# EAGLE schematic Front Node_MiniLock (EAGLE 8.1.0)
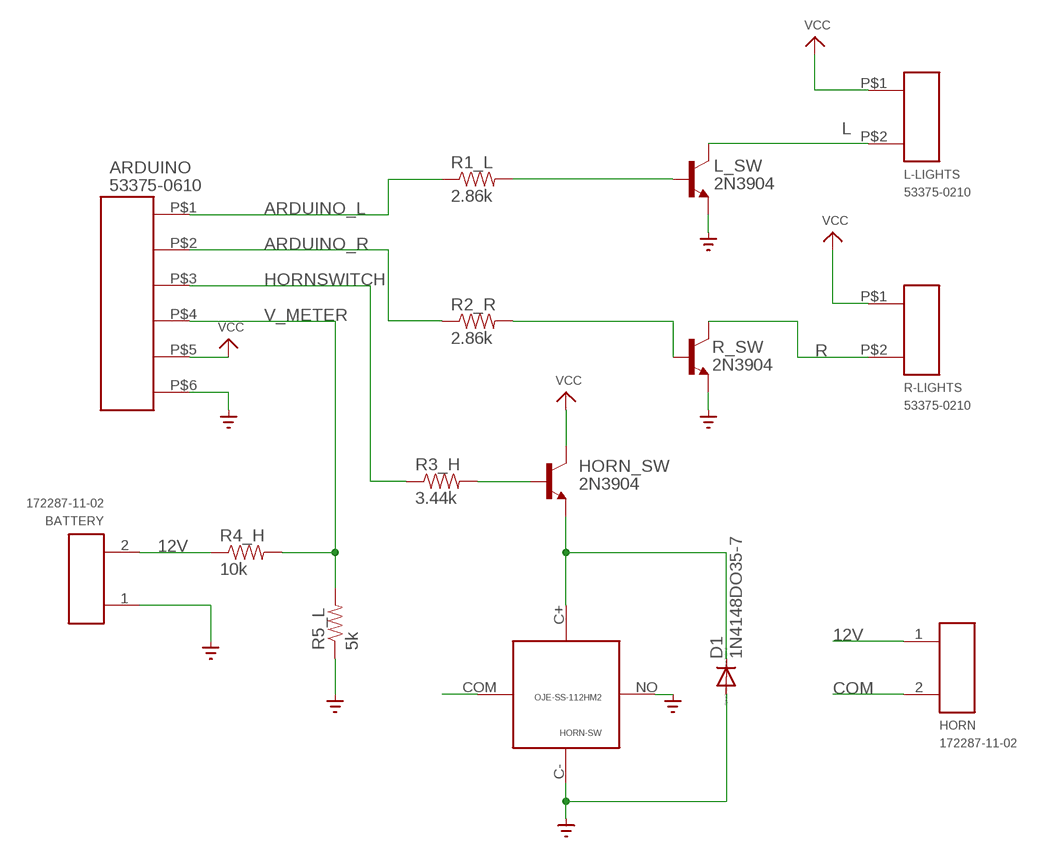
[diagram p0: schematic, sheet 1]

## Parts
ARDUINO  53375-0610  [53375-0610-MINI-LOCK]
BATTERY  172287-11-02  [172287-ULTRA-FIT]
D1  1N4148DO35-7  [DO35-7]
HORN  172287-11-02  [172287-ULTRA-FIT]
HORN-SW  OJE-SS-112HM2  [OJE-SS-112HM2-SPST-RELAY]
HORN_SW  2N3904  [TO92]
L-LIGHTS  53375-0210  [53375-0210-MINI-LOCK]
L_SW  2N3904  [TO92]
R1_L  2.86k  RESISTORPTH-1/6W  [1/6W-RES]
R2_R  2.86k  RESISTORPTH-1/6W  [1/6W-RES]
R3_H  3.44k  RESISTORPTH-1/6W  [1/6W-RES]
R4_H  10k  RESISTORPTH-1/6W  [1/6W-RES]
R5_L  5k  RESISTORPTH-1/6W  [1/6W-RES]
R-LIGHTS  53375-0210  [53375-0210-MINI-LOCK]
R_SW  2N3904  [TO92]

## Nets
12V: BATTERY.2 HORN.1 R4_H.1
ARDUINO_L: ARDUINO.P$1 R1_L.1
ARDUINO_R: ARDUINO.P$2 R2_R.1
COM: HORN-SW.COM HORN.2
GND: ARDUINO.P$6 BATTERY.1 D1.A HORN-SW.C- HORN-SW.NO L_SW.3(E) R5_L.1 R_SW.3(E) ; supply symbol labelled GND_
HORNSWITCH: ARDUINO.P$3 R3_H.1
L: L-LIGHTS.P$2 L_SW.1(C)
N$1: HORN_SW.2(B) R3_H.2
N$2: R2_R.2 R_SW.2(B)
N$3: D1.C HORN-SW.C+ HORN_SW.3(E)
N$8: L_SW.2(B) R1_L.2
R: R-LIGHTS.P$2 R_SW.1(C)
V_METER: ARDUINO.P$4 R4_H.2 R5_L.2
VCC: ARDUINO.P$5 HORN_SW.1(C) L-LIGHTS.P$1 R-LIGHTS.P$1

## Library data of the parts
ARDUINO = Hooman:53375-0610: Mini-Lock Header 6 pin 53375 series
BATTERY HORN = Hooman:172287-11-02: Ultra-Fit™ 172287 Header Molex 3.5 mm pitch 2 pin connector header
D1 = diode:1N4148: DIODE high speed (Philips)
HORN-SW = Hooman:OJE-SS-112HM2: TE SPST RELAY
HORN_SW L_SW R_SW = transistor-neu-to92:2N3904: NPN TRANSISTOR
L-LIGHTS R-LIGHTS = Hooman:53375-0210: Mini-Lock Header 2 pin 53375 series
R1_L R2_R R3_H R4_H R5_L = SparkFun-Passives:RESISTOR: Resistor Basic schematic elements and footprints for 0603, 1206, and PTH resistors.